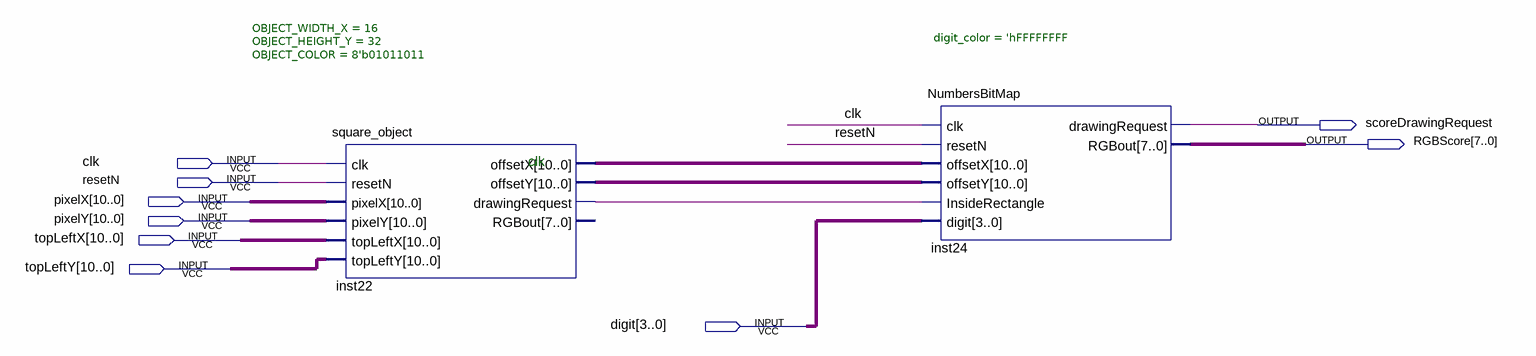
[diagram p0: schematic sheet]
// Quartus schematic SCORE_DISPLAY.bdf as structural Verilog: 2 symbols, 9 pins
module SCORE_DISPLAY (
  input  clk,
  input  resetN,
  input  [10:0] pixelX,
  input  [10:0] pixelY,
  input  [10:0] topLeftX,
  input  [10:0] topLeftY,
  input  [3:0] digit,
  output scoreDrawingRequest,
  output [7:0] RGBScore
);

  wire inst22_drawingrequest;
  wire [10:0] inst22_offsetx, inst22_offsety;

  square_object #(.OBJECT_WIDTH_X(16), .OBJECT_HEIGHT_Y(32), .OBJECT_COLOR(8'b01011011)) inst22 (
    .clk(clk), .resetN(resetN), .pixelX(pixelX), .pixelY(pixelY), .topLeftX(topLeftX), .topLeftY(topLeftY),
    .offsetX(inst22_offsetx), .offsetY(inst22_offsety), .drawingRequest(inst22_drawingrequest));  // open: RGBout
  NumbersBitMap #(.digit_color('hFFFFFFFF)) inst24 (
    .clk(clk), .resetN(resetN), .offsetX(inst22_offsetx), .offsetY(inst22_offsety),
    .InsideRectangle(inst22_drawingrequest), .digit(digit), .drawingRequest(scoreDrawingRequest),
    .RGBout(RGBScore));

  // Notes on the sheet:
  //   clk
endmodule
